# Altium schematic sheet 13_IO_ETH.SchDoc
size A3; DocumentNumber: 13; SheetNumber: 13; SheetTotal: 21
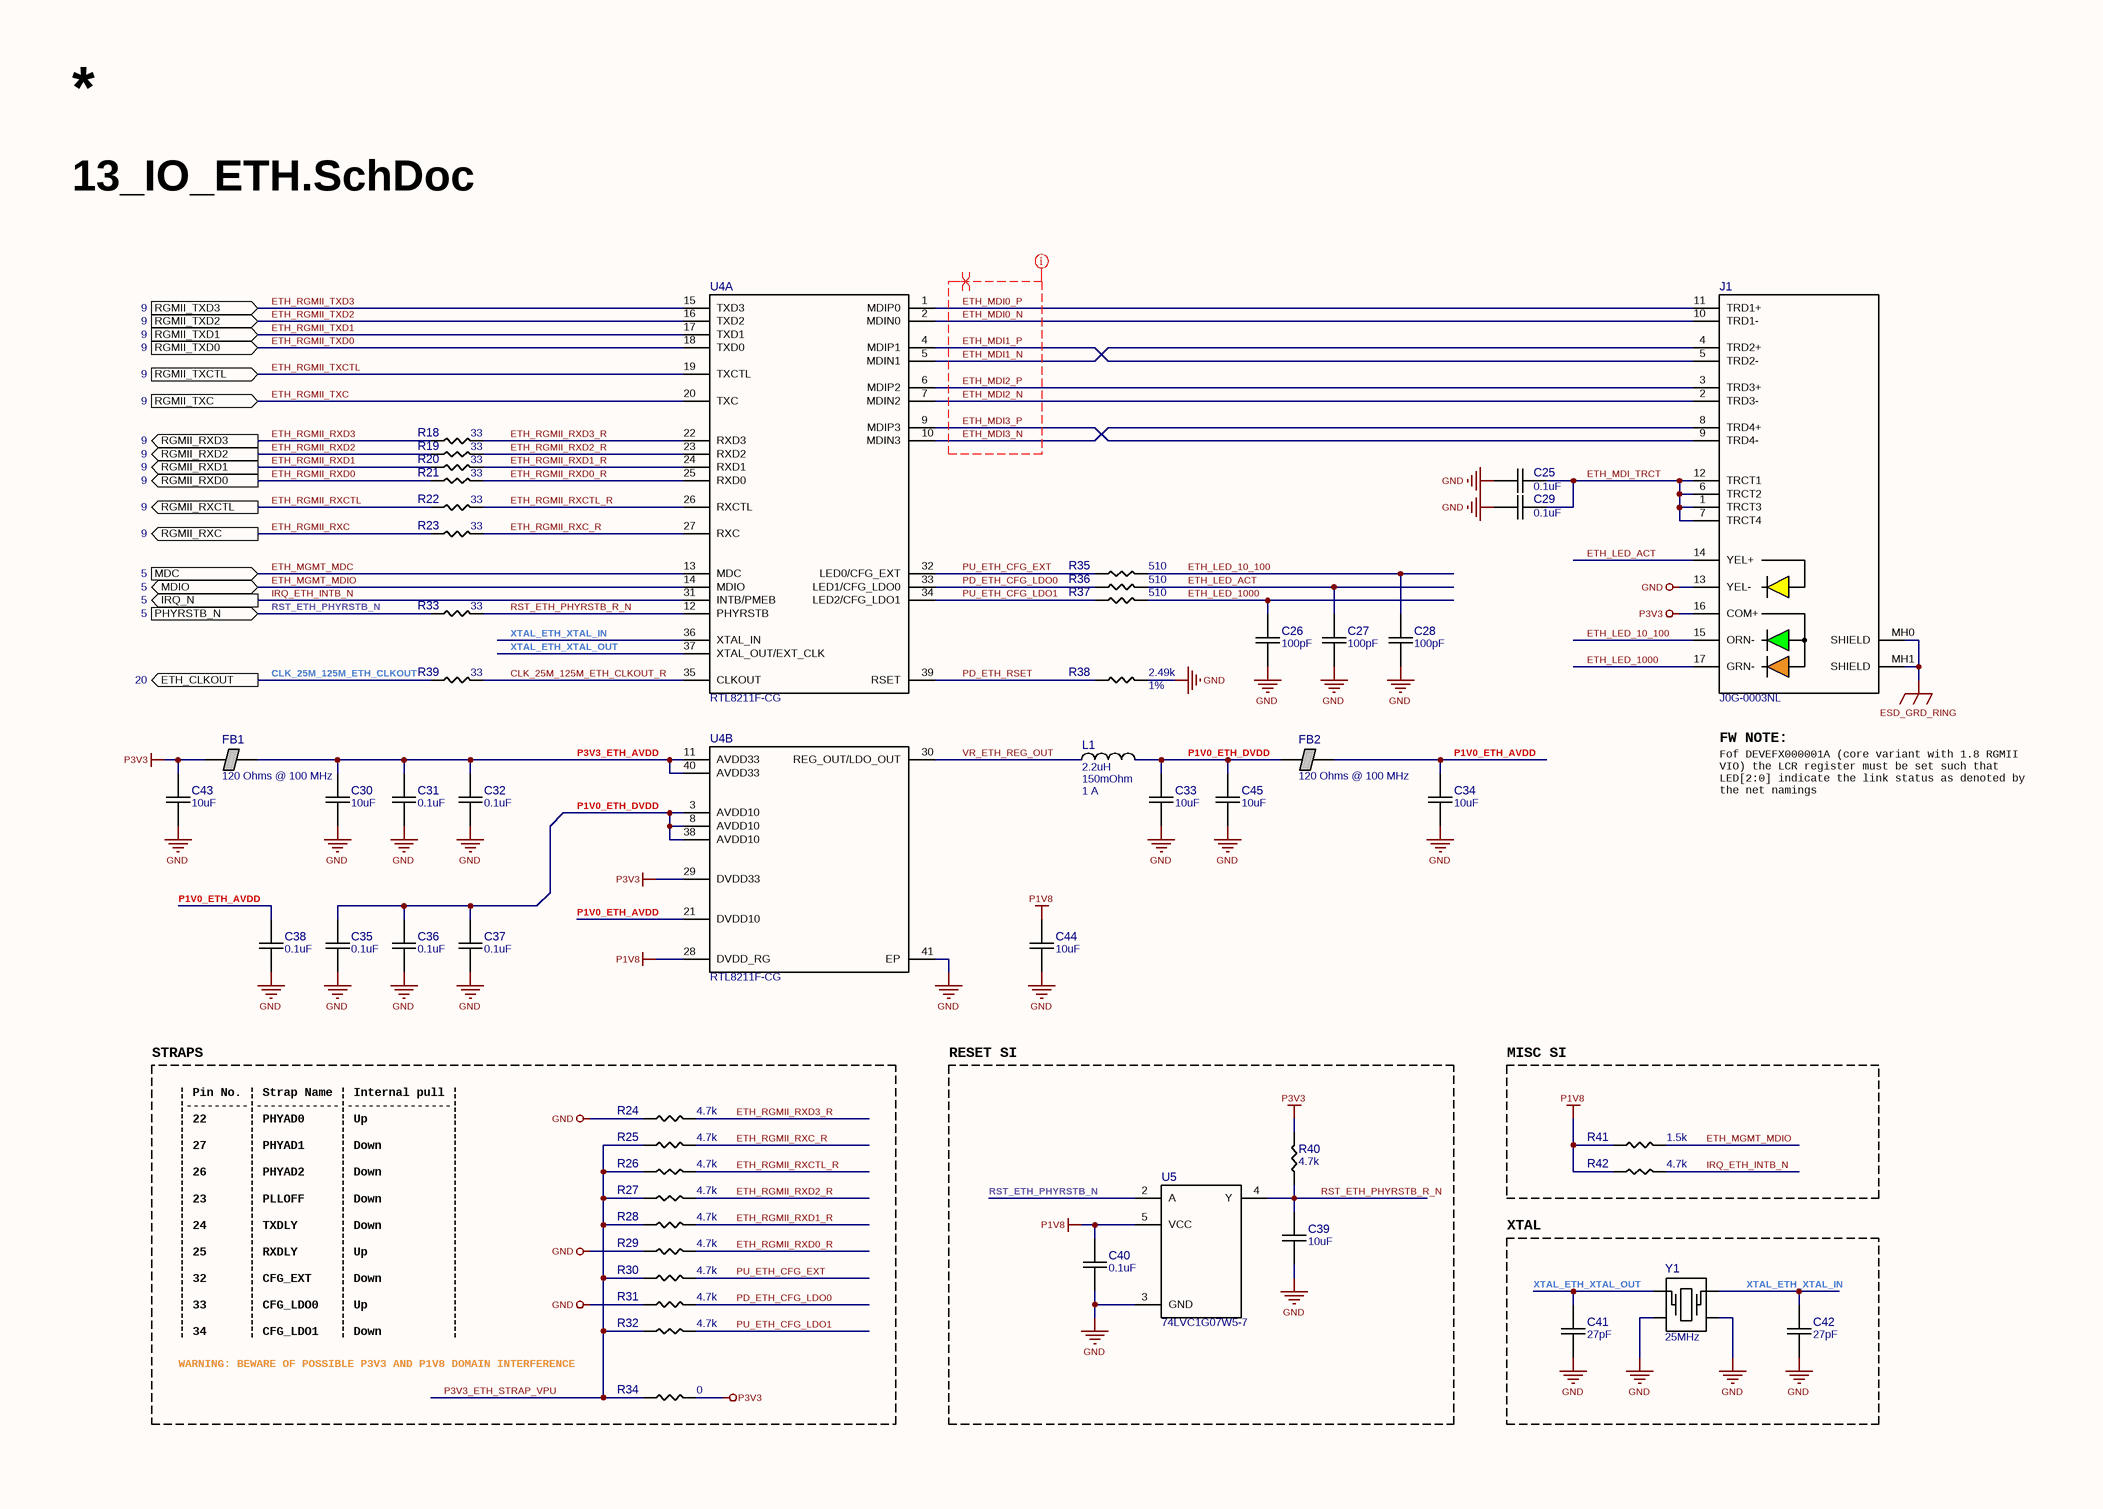
[diagram p0: 13_IO_ETH.SchDoc]

## Parts
C25  0.1uF  [CAPC1005X06N]
C26  100pF  [CAPC1005X06N]
C27  100pF  [CAPC1005X06N]
C28  100pF  [CAPC1005X06N]
C29  0.1uF  [CAPC1005X06N]
C30  10uF  [CAPC1005X06N]
C31  0.1uF  [CAPC1005X06N]
C32  0.1uF  [CAPC1005X06N]
C33  10uF  [CAPC1005X06N]
C34  10uF  [CAPC1005X06N]
C35  0.1uF  [CAPC1005X06N]
C36  0.1uF  [CAPC1005X06N]
C37  0.1uF  [CAPC1005X06N]
C38  0.1uF  [CAPC1005X06N]
C39  10uF  [CAPC1005X06N]
C40  0.1uF  [CAPC1005X06N]
C41  27pF  [CAPC1005X06N]
C42  27pF  [CAPC1005X06N]
C43  10uF  [CAPC1005X06N]
C44  10uF  [CAPC1005X06N]
C45  10uF  [CAPC1005X06N]
FB1  120 Ohms @ 100 MHz  [INDC1005X05N]
FB2  120 Ohms @ 100 MHz  [INDC1005X05N]
J1  J0G-0003NL  [PULSE_J0G-0003NL]
L1  2.2uH  DCR: 150mOhm  Ir: 1 A  [INDC2520X12N]
R18  33  [RESC1005X03N]
R19  33  [RESC1005X03N]
R20  33  [RESC1005X03N]
R21  33  [RESC1005X03N]
R22  33  [RESC1005X03N]
R23  33  [RESC1005X03N]
R24  4.7k  [RESC1005X03N]
R25  4.7k  [RESC1005X03N]
R26  4.7k  [RESC1005X03N]
R27  4.7k  [RESC1005X03N]
R28  4.7k  [RESC1005X03N]
R29  4.7k  [RESC1005X03N]
R30  4.7k  [RESC1005X03N]
R31  4.7k  [RESC1005X03N]
R32  4.7k  [RESC1005X03N]
R33  33  [RESC1005X03N]
R34  0  [RESC1005X03N]
R35  510  [RESC1005X03N]
R36  510  [RESC1005X03N]
R37  510  [RESC1005X03N]
R38  2.49k  Tol: 1%  [RESC1005X03N]
R39  33  [RESC1005X03N]
R40  4.7k  [RESC1005X03N]
R41  1.5k  [RESC1005X03N]
R42  4.7k  [RESC1005X03N]
U4  RTL8211F-CG  [QFN40P500X500X90_HS-41N]  (parts A,B of 2)
U5  74LVC1G07W5-7  [SOT95P280X145-5N]
Y1  25MHz  [XTAL_3225]

## Blocks framed on the sheet
STRAPS: R24-R32 R34
RESET SI: C39 C40 R40 U5
MISC SI: R41 R42
XTAL: C41 C42 Y1

## Ports
ETH_CLKOUT (out, see 20), IRQ_N (out, see 5), MDC (in, see 5), MDIO (bidir, see 5), PHYRSTB_N (in, see 5), RGMII_RXC (out, see 9), RGMII_RXCTL (out, see 9), RGMII_RXD0 (out, see 9), RGMII_RXD1 (out, see 9), RGMII_RXD2 (out, see 9), RGMII_RXD3 (out, see 9), RGMII_TXC (in, see 9), RGMII_TXCTL (in, see 9), RGMII_TXD0 (in, see 9), RGMII_TXD1 (in, see 9), RGMII_TXD2 (in, see 9), RGMII_TXD3 (in, see 9)

## Nets
ESD_GRD_RING: J1.MH0(SHIELD) J1.MH1(SHIELD)
GND: C25.1 C26.1 C27.1 C28.1 C29.1 C30.1 C31.1 C32.1 C33.1 C34.1 C35.1 C36.1 C37.1 C38.1 C39.1 C40.1 C41.1 C42.1 C43.1 C44.1 C45.1 J1.13(YEL-) R24.1 R29.1 R31.1 R38.2 U4.41(EP) U5.3(GND) Y1.2 Y1.4
P1V8: C40.2 C44.2 R41.1 R42.1 U4.28(DVDD_RG) U5.5(VCC)
P3V3: C43.2 FB1.1 J1.16(COM+) R34.2 R40.2 U4.29(DVDD33)
CLK_25M_125M_ETH_CLKOUT: R39.1 ; port ETH_CLKOUT
CLK_25M_125M_ETH_CLKOUT_R: R39.2 U4.35(CLKOUT)
ETH_LED_10_100: C28.2 J1.15(ORN-) R35.2
ETH_LED_1000: C26.2 J1.17(GRN-) R37.2
ETH_LED_ACT: C27.2 J1.14(YEL+) R36.2
ETH_MDI0_N: J1.10(TRD1-) U4.2(MDIN0)
ETH_MDI0_P: J1.11(TRD1+) U4.1(MDIP0)
ETH_MDI1_N: J1.4(TRD2+) U4.5(MDIN1)
ETH_MDI1_P: J1.5(TRD2-) U4.4(MDIP1)
ETH_MDI2_N: J1.2(TRD3-) U4.7(MDIN2)
ETH_MDI2_P: J1.3(TRD3+) U4.6(MDIP2)
ETH_MDI3_N: J1.8(TRD4+) U4.10(MDIN3)
ETH_MDI3_P: J1.9(TRD4-) U4.9(MDIP3)
ETH_MDI_TRCT: C25.2 C29.2 J1.1(TRCT3) J1.6(TRCT2) J1.7(TRCT4) J1.12(TRCT1)
ETH_MGMT_MDC: U4.13(MDC) ; port MDC
ETH_MGMT_MDIO: R41.2 U4.14(MDIO) ; port MDIO
ETH_RGMII_RXC: R23.1 ; port RGMII_RXC
ETH_RGMII_RXC_R: R23.2 R25.2 U4.27(RXC)
ETH_RGMII_RXCTL: R22.1 ; port RGMII_RXCTL
ETH_RGMII_RXCTL_R: R22.2 R26.2 U4.26(RXCTL)
ETH_RGMII_RXD0: R21.1 ; port RGMII_RXD0
ETH_RGMII_RXD0_R: R21.2 R29.2 U4.25(RXD0)
ETH_RGMII_RXD1: R20.1 ; port RGMII_RXD1
ETH_RGMII_RXD1_R: R20.2 R28.2 U4.24(RXD1)
ETH_RGMII_RXD2: R19.1 ; port RGMII_RXD2
ETH_RGMII_RXD2_R: R19.2 R27.2 U4.23(RXD2)
ETH_RGMII_RXD3: R18.1 ; port RGMII_RXD3
ETH_RGMII_RXD3_R: R18.2 R24.2 U4.22(RXD3)
ETH_RGMII_TXC: U4.20(TXC) ; port RGMII_TXC
ETH_RGMII_TXCTL: U4.19(TXCTL) ; port RGMII_TXCTL
ETH_RGMII_TXD0: U4.18(TXD0) ; port RGMII_TXD0
ETH_RGMII_TXD1: U4.17(TXD1) ; port RGMII_TXD1
ETH_RGMII_TXD2: U4.16(TXD2) ; port RGMII_TXD2
ETH_RGMII_TXD3: U4.15(TXD3) ; port RGMII_TXD3
IRQ_ETH_INTB_N: R42.2 U4.31(INTB/PMEB) ; port IRQ_N
P1V0_ETH_AVDD: C34.2 C38.2 FB2.2 U4.21(DVDD10)
P1V0_ETH_DVDD: C33.2 C35.2 C36.2 C37.2 C45.2 FB2.1 L1.2 U4.3(AVDD10) U4.8(AVDD10) U4.38(AVDD10)
P3V3_ETH_AVDD: C30.2 C31.2 C32.2 FB1.2 U4.11(AVDD33) U4.40(AVDD33)
P3V3_ETH_STRAP_VPU: R25.1 R26.1 R27.1 R28.1 R30.1 R32.1 R34.1
PD_ETH_CFG_LDO0: R31.2 R36.1 U4.33(LED1/CFG_LDO0)
PD_ETH_RSET: R38.1 U4.39(RSET)
PU_ETH_CFG_EXT: R30.2 R35.1 U4.32(LED0/CFG_EXT)
PU_ETH_CFG_LDO1: R32.2 R37.1 U4.34(LED2/CFG_LDO1)
RST_ETH_PHYRSTB_N: R33.1 U5.2(A) ; port PHYRSTB_N
RST_ETH_PHYRSTB_R_N: C39.2 R33.2 R40.1 U4.12(PHYRSTB) U5.4(Y)
VR_ETH_REG_OUT: L1.1 U4.30(REG_OUT/LDO_OUT)
XTAL_ETH_XTAL_IN: C42.2 U4.36(XTAL_IN) Y1.3
XTAL_ETH_XTAL_OUT: C41.2 U4.37(XTAL_OUT/EXT_CLK) Y1.1

## Layout directives
differential pair; differential pair class 100D: ETH_MDI0_N, ETH_MDI0_P, ETH_MDI1_N, ETH_MDI1_P, ETH_MDI2_N, ETH_MDI2_P, ETH_MDI3_N, ETH_MDI3_P
net class MDI: ETH_MDI0_N, ETH_MDI0_P, ETH_MDI1_N, ETH_MDI1_P, ETH_MDI2_N, ETH_MDI2_P, ETH_MDI3_N, ETH_MDI3_P

## Notes on the sheet
- FW NOTE:
- Fof DEVEFX000001A (core variant with 1.8 RGMII VIO) the LCR register must be set such that LED[2:0] indicate the link status as denoted by the net namings
- | Pin No. | Strap Name | Internal pull |
- |---------|------------|---------------|
- | 22      | PHYAD0     | Up            |
- |         |            |               |
- | 27      | PHYAD1     | Down          |
- | 26      | PHYAD2     | Down          |
- | 23      | PLLOFF     | Down          |
- | 24      | TXDLY      | Down          |
- | 25      | RXDLY      | Up            |
- | 32      | CFG_EXT    | Down          |
- | 33      | CFG_LDO0   | Up            |
- | 34      | CFG_LDO1   | Down          |
- WARNING: BEWARE OF POSSIBLE P3V3 AND P1V8 DOMAIN INTERFERENCE

## Library data of the parts
C25 C29 C31 C32 C35-C38 C40 = GRM155R71E104KE14J: CAP CER 0.1UF 25V X7R 0402; Manufacturer 1: Murata Electronics; Tol: 10%; Part Number: GRM155R71E104KE14J; Value: 0.1uF; Voltage: 25V; TempC: X7R; Manufacturer Part Number 1: GRM155R71E104KE14J; Supplier 1: Digi-Key; Supplier Part Number 1: 490-14603-1-ND
C26-C28 = GCM1555C1H101FA16J: CAP CER 100PF 50V C0G/NP0 0402; Manufacturer 1: Murata Electronics; Tol: 1%; Part Number: GCM1555C1H101FA16J; Value: 100pF; Voltage: 50V; TempC: C0G/NP0; Manufacturer Part Number 1: GCM1555C1H101FA16J; Supplier 1: Digi-Key; Supplier Part Number 1: 490-GCM1555C1H101FA16JTR-ND
C30 C33 C34 C39 C43-C45 = GRM155R60J106ME47D: CAP CER 10UF 6.3V X5R 0402; Manufacturer 1: Murata Electronics; Tol: 20%; Part Number: GRM155R60J106ME47D; Value: 10uF; Voltage: 6.3V; TempC: X5R; Manufacturer Part Number 1: GRM155R60J106ME47D; Supplier 1: Digi-Key; Supplier Part Number 1: 490-13239-1-ND
C41 C42 = CC0402JRNPO9BN270: CAP CER 27PF 50V C0G/NPO 0402; Manufacturer 1: Yageo; Tol: 5%; TempC: C0G/NP0; Part Number: CC0402JRNPO9BN270; Value: 27pF; Voltage: 50V; Manufacturer Part Number 1: CC0402JRNPO9BN270; Supplier 1: Digi-Key; Supplier Part Number 1: 311-1019-1-ND
FB1 FB2 = BLM15PD121SN1D: FERRITE BEAD 120 OHM 0402 1LN; Manufacturer 1: Murata Electronics; DCR: 90mOhm; Ir: 1.3A; Part Number: BLM15PD121SN1D; Value: 120 Ohms @ 100 MHz; Manufacturer Part Number 1: BLM15PD121SN1D; Supplier 1: Digi-Key; Supplier Part Number 1: 490-5203-1-ND
J1 = J0G-0003NL: CONN JACK 1PORT 1000 BASE-T PCB; Manufacturer 1: Pulse Electronics Network; Part Number: J0G-0003NL; Manufacturer Part Number 1: J0G-0003NL; Supplier 1: Digi-Key; Supplier Part Number 1: 553-1852-ND
L1 = LQM2HPN2R2MJ0L: FIXED IND 2.2UH 1A 150 MOHM SMD; Manufacturer 1: Murata Electronics; Part Number: LQM2HPN2R2MJ0L; Value: 2.2uH; Manufacturer Part Number 1: LQM2HPN2R2MJ0L; Supplier 1: Digi-Key; Supplier Part Number 1: 490-6700-1-ND
R18-R23 R33 R39 = RC0402FR-0733RL: RES SMD 33 OHM 1% 1/16W 0402; Manufacturer 1: Yageo; Part Number: RC0402FR-0733RL; Value: 33; Tol: 1%; Manufacturer Part Number 1: RC0402FR-0733RL; Supplier 1: Digi-Key; Supplier Part Number 1: 311-33.0LRCT-ND
R24-R32 R40 R42 = RC0402FR-074K7L: RES SMD 4.7K OHM 1% 1/16W 0402; Manufacturer 1: Yageo; Part Number: RC0402FR-074K7L; Value: 4.7k; Tol: 1%; Manufacturer Part Number 1: RC0402FR-074K7L; Supplier 1: Digi-Key; Supplier Part Number 1: 311-4.7KLRCT-ND
R34 = RC0402FR-070RL: RES SMD 0 OHM JUMPER 1/16W 0402; Manufacturer 1: Yageo; Tol: 1%; Part Number: RC0402FR-070RL; Value: 0; Manufacturer Part Number 1: RC0402FR-070RL; Supplier 1: Digi-Key; Supplier Part Number 1: 311-0.0LRCT-ND
R35-R37 = RC0402JR-07510RL: RES 510 OHM 5% 1/16W 0402; Manufacturer 1: Yageo; Tol: 1%; Part Number: RC0402JR-07510RL; Value: 510; Manufacturer Part Number 1: RC0402JR-07510RL; Supplier 1: Digi-Key; Supplier Part Number 1: 311-510JRCT-ND
R38 = RC0402FR-072K49L: RES SMD 2.49K OHM 1% 1/16W 0402; Manufacturer 1: Yageo; Part Number: RC0402FR-072K49L; Value: 2.49k; Manufacturer Part Number 1: RC0402FR-072K49L; Supplier 1: Digi-Key; Supplier Part Number 1: 311-2.49KLRCT-ND
R41 = RC0402FR-071K5L: RES 1.5K OHM 1% 1/16W 0402; Manufacturer 1: Yageo; Part Number: RC0402FR-071K5L; Value: 1.5k; Tol: 1%; Manufacturer Part Number 1: RC0402FR-071K5L; Supplier 1: Digi-Key; Supplier Part Number 1: 311-1.50KLRCT-ND
U4 = RTL8211F-CG: Phy 1-CH 10MBPS/100MBPS/1GBPS 3.3V 40-PIN QFN Ep; Manufacturer 1: Realtek; Part Number: RTL8211F-CG; Manufacturer Part Number 1: RTL8211F-CG
U5 = 74LVC1G07W5-7: IC BUFFER NON-INVERT 5.5V SOT25; Manufacturer 1: Diodes Incorporated; Part Number: 74LVC1G07W5-7; Manufacturer Part Number 1: 74LVC1G07W5-7; Supplier 1: Digi-Key; Supplier Part Number 1: 74LVC1G07W5-7DICT-ND
Y1 = TSX-3225 25.0000MF10P-C0: CRYSTAL 25.0000MHZ 18PF SMD; Manufacturer 1: EPSON; Part Number: TSX-3225 25.0000MF10P-C0; Value: 25MHz; Manufacturer Part Number 1: TSX-3225 25.0000MF10P-C0; Supplier 1: Digi-Key; Supplier Part Number 1: SER4211TR-ND